# EAGLE design ovládací panel (EAGLE 9.5.1)
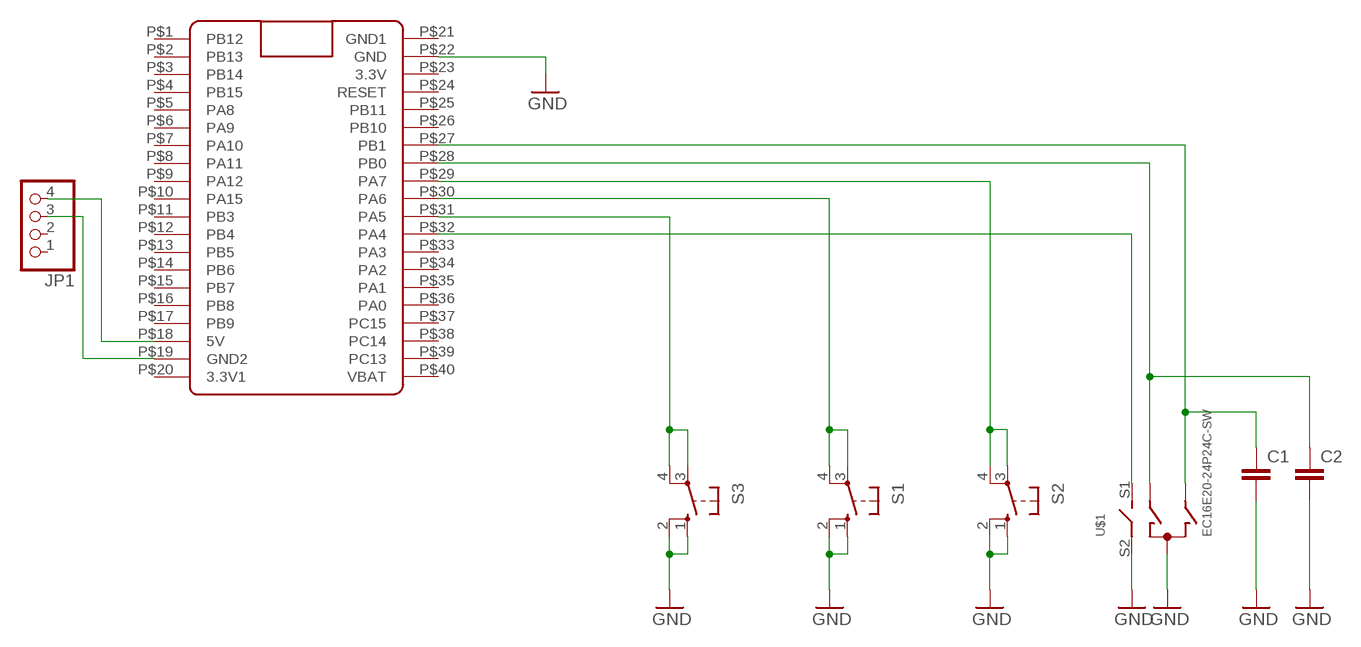
[diagram p0: schematic, sheet 1]

## Parts
C1  C-EUC0805  [C0805]
C2  C-EUC0805  [C0805]
JP1  PINHD-1X4  [1X04]
S1  10-XX  [B3F-10XX]
S2  10-XX  [B3F-10XX]
S3  10-XX  [B3F-10XX]
U$1  EC16E20-24P24C-SW  [EC16E20-24P24C-SW]
U$2  BLUE_PILL  [BLUE_PILL]

## Nets
GND: C1.2 C2.2 S1.1(S) S1.2(S1) S2.1(S) S2.2(S1) S3.1(S) S3.2(S1) U$1.C U$1.S2 U$2.P$22(GND)
N$1: S3.3(P) S3.4(P1) U$2.P$31(PA5)
N$2: S1.3(P) S1.4(P1) U$2.P$30(PA6)
N$3: S2.3(P) S2.4(P1) U$2.P$29(PA7)
N$4: JP1.4 U$2.P$18(5V)
N$5: C2.1 U$1.A U$2.P$28(PB0)
N$6: C1.1 U$1.B U$2.P$27(PB1)
N$7: U$1.S1 U$2.P$32(PA4)
N$8: JP1.3 U$2.P$19(GND2)
Unconnected: JP1.1 JP1.2 U$2.P$1(PB12) U$2.P$2(PB13) U$2.P$3(PB14) U$2.P$4(PB15) U$2.P$5(PA8) U$2.P$6(PA9) U$2.P$7(PA10) U$2.P$8(PA11) U$2.P$9(PA12) U$2.P$10(PA15) U$2.P$11(PB3) U$2.P$12(PB4) U$2.P$13(PB5) U$2.P$14(PB6) U$2.P$15(PB7) U$2.P$16(PB8) U$2.P$17(PB9) U$2.P$20(3.3V1) U$2.P$23(3.3V) U$2.P$24(RESET) U$2.P$25(PB11) U$2.P$26(PB10) U$2.P$33(PA3) U$2.P$34(PA2) U$2.P$35(PA1) U$2.P$36(PA0) U$2.P$37(PC15) U$2.P$38(PC14) U$2.P$39(PC13) U$2.P$40(VBAT)

## Power pins joined to a net without a drawn wire
GND1: U$2.P$21(GND1)

## Library data of the parts
C1 C2 = rcl:C-EU: CAPACITOR, European symbol; SPICEPREFIX: C
JP1 = pinhead:PINHD-1X4: PIN HEADER
S1-S3 = switch-omron:10-XX: OMRON SWITCH; MPN: B3F-1000; OC_FARNELL: 176432; OC_NEWARK: 36M3542
U$1 = encoder:EC16E20-24P24C-SW
U$2 = BluePill:BLUE_PILL

## Board
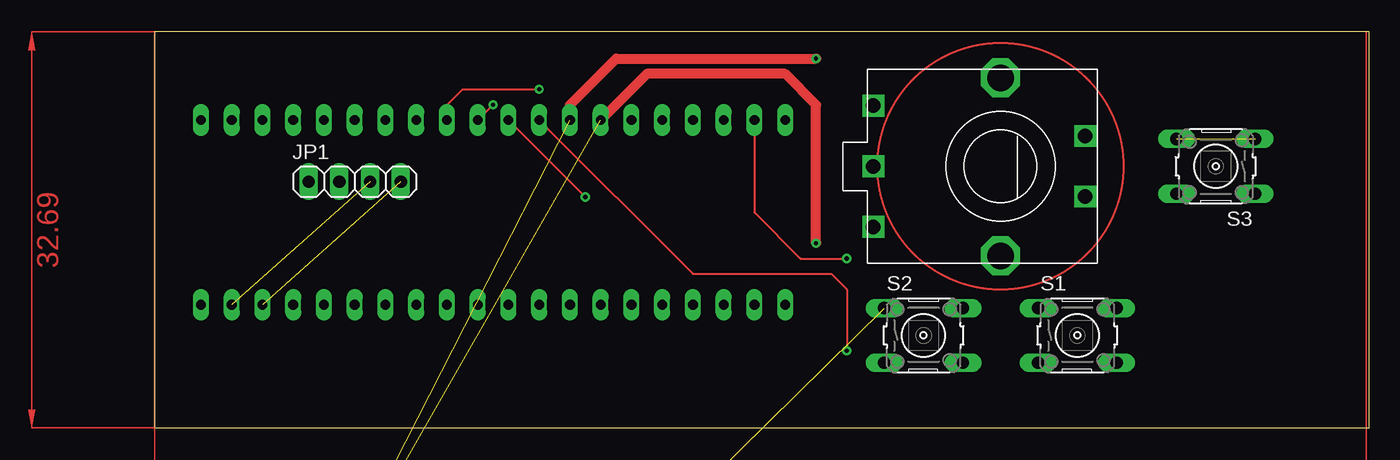
[diagram p1: board, top side]
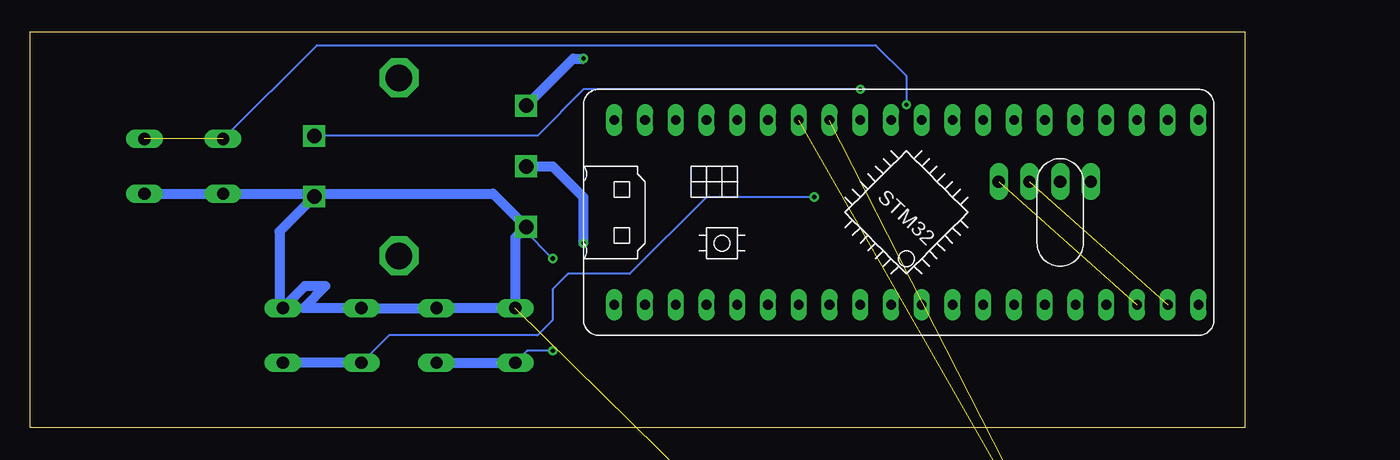
[diagram p2: board, bottom side, seen from below]

Size 100.31 x 32.69 mm. Coordinates in mm from the lower left corner, seen from the top.
Outline: 0,0 100.31,0 100.31,32.69 0,32.69 0,0
Copper layers (1*16): Top 0.035mm / dielectric 1.5mm / Bottom 0.035mm
Design rules "default": minimum track width 6mil, minimum drill 0.35mm, track to track 6mil, track to pad 6mil, pad to pad 6mil, via to via 6mil, smd to smd 6mil, copper to edge 40mil, drill to drill 6mil, minimum pad ring 10mil, minimum via ring 8mil, stop-mask expansion 4mil, vias tented up to drill 0mil, thermal gap 10mil

### Footprints (pad centres in the part's own frame; a part is rotated, then mirrored left to right if it is on the bottom)
C0805 = smd 1.3 x 1.5: 1 -0.95,0; 2 0.95,0
1X04 = drill 1.016 long: 1 -3.81,0; 2 -1.27,0; 3 1.27,0; 4 3.81,0
B3F-10XX = drill 1.016 long: 1 -3.251,2.261; 2 3.251,2.261; 3 -3.251,-2.261; 4 3.251,-2.261
EC16E20-24P24C-SW = drill 1.2 square: A -5,-10.5; B 0,-10.5; C 5,-10.5; S1 -2.5,7; S2 2.5,7 | drill 2.2 octagon: P$1 -7.3,0; P$2 7.4,0
BLUE_PILL = drill 0.8 long: P$1 -7.62,15.24; P$2 -7.62,12.7; P$3 -7.62,10.16; P$4 -7.62,7.62; P$5 -7.62,5.08; P$6 -7.62,2.54; P$7 -7.62,0; P$8 -7.62,-2.54; P$9 -7.62,-5.08; P$10 -7.62,-7.62; P$11 -7.62,-10.16; P$12 -7.62,-12.7; P$13 -7.62,-15.24; P$14 -7.62,-17.78; P$15 -7.62,-20.32; P$16 -7.62,-22.86; P$17 -7.62,-25.4; P$18 -7.62,-27.94; P$19 -7.62,-30.48; P$20 -7.62,-33.02; P$21 7.62,15.24; P$22 7.62,12.7; P$23 7.62,10.16; P$24 7.62,7.62; P$25 7.62,5.08; P$26 7.62,2.54; P$27 7.62,0; P$28 7.62,-2.54; P$29 7.62,-5.08; P$30 7.62,-7.62; P$31 7.62,-10.16; P$32 7.62,-12.7; P$33 7.62,-15.24; P$34 7.62,-17.78; P$35 7.62,-20.32; P$36 7.62,-22.86; P$37 7.62,-25.4; P$38 7.62,-27.94; P$39 7.62,-30.48; P$40 7.62,-33.02

### Placement (x,y rotation side)
C1  -10.16,-58.42 0 top  (outside the outline)
C2  -10.16,-63.5 0 top  (outside the outline)
JP1  16.51,20.32 0 top
S1  76.2,7.62 0 top
S2  63.5,7.62 0 top
S3  87.63,21.59 180 top
U$1  69.85,21.59 270 top
U$2  36.83,17.78 90 bottom

### Tracks (layer width: path | path; a pad name or v marks a point on that pad's centre or on a via)
GND  (via drill 0.35)  (2 unrouted)
  Top 0.152: U$2.P$22 49.53,17.78 53.34,13.97 v57.15,13.97
  Bottom 0.152: v57.15,13.97 59.56,16.38
  Bottom 0.813: U$1.S2 79.73,16.21 79.73,9.88 S1.2 77.62,11.71 75.92,11.71 77.75,9.88 S1.1 S2.2 S2.1 60.25,15.69 59.56,16.38 U$1.C 62.09,19.33 S3.1 S3.2
N$1  (via drill 0.35)  (1 unrouted)
  Top 0.152: v27.94,26.67 U$2.P$31
  Bottom 0.152: S3.4 76.63,31.6 30.48,31.6 27.94,29.06 v27.94,26.67
N$2  (via drill 0.35)
  Top 0.152: U$2.P$30 v35.56,19.05
  Bottom 0.152: v35.56,19.05 44.45,19.05 50.8,12.7 55.88,12.7 57.15,11.43 57.15,8.89 58.42,7.62 70.69,7.62 S1.3
  Bottom 0.813: S1.3 S1.4
N$3  (via drill 0.35)
  Top 0.152: U$2.P$29 44.45,12.7 55.88,12.7 57.15,11.43 v57.15,6.35
  Bottom 0.152: v57.15,6.35 59.26,6.35 S2.3
  Bottom 0.813: S2.4 S2.3
N$4  (1 unrouted)
N$5  (via drill 0.35)  (1 unrouted)
  Top 0.813: U$2.P$28 34.29,26.67 38.1,30.48 v54.61,30.48
  Bottom 0.813: U$1.A 55.46,30.48 v54.61,30.48
N$6  (via drill 0.35)  (1 unrouted)
  Top 0.813: v54.61,15.24 54.61,26.67 52.07,29.21 40.64,29.21 U$2.P$27
  Bottom 0.813: v54.61,15.24 54.61,19.05 57.15,21.59 U$1.B
N$7  (via drill 0.35)
  Top 0.152: U$2.P$32 24.13,26.67 25.4,27.94 v31.75,27.94
  Bottom 0.152: v31.75,27.94 54.61,27.94 58.42,24.13 76.81,24.13 U$1.S1
N$8  (1 unrouted)
(copper drawn outside any net)
  shapes: Top area x2, Top circle x1